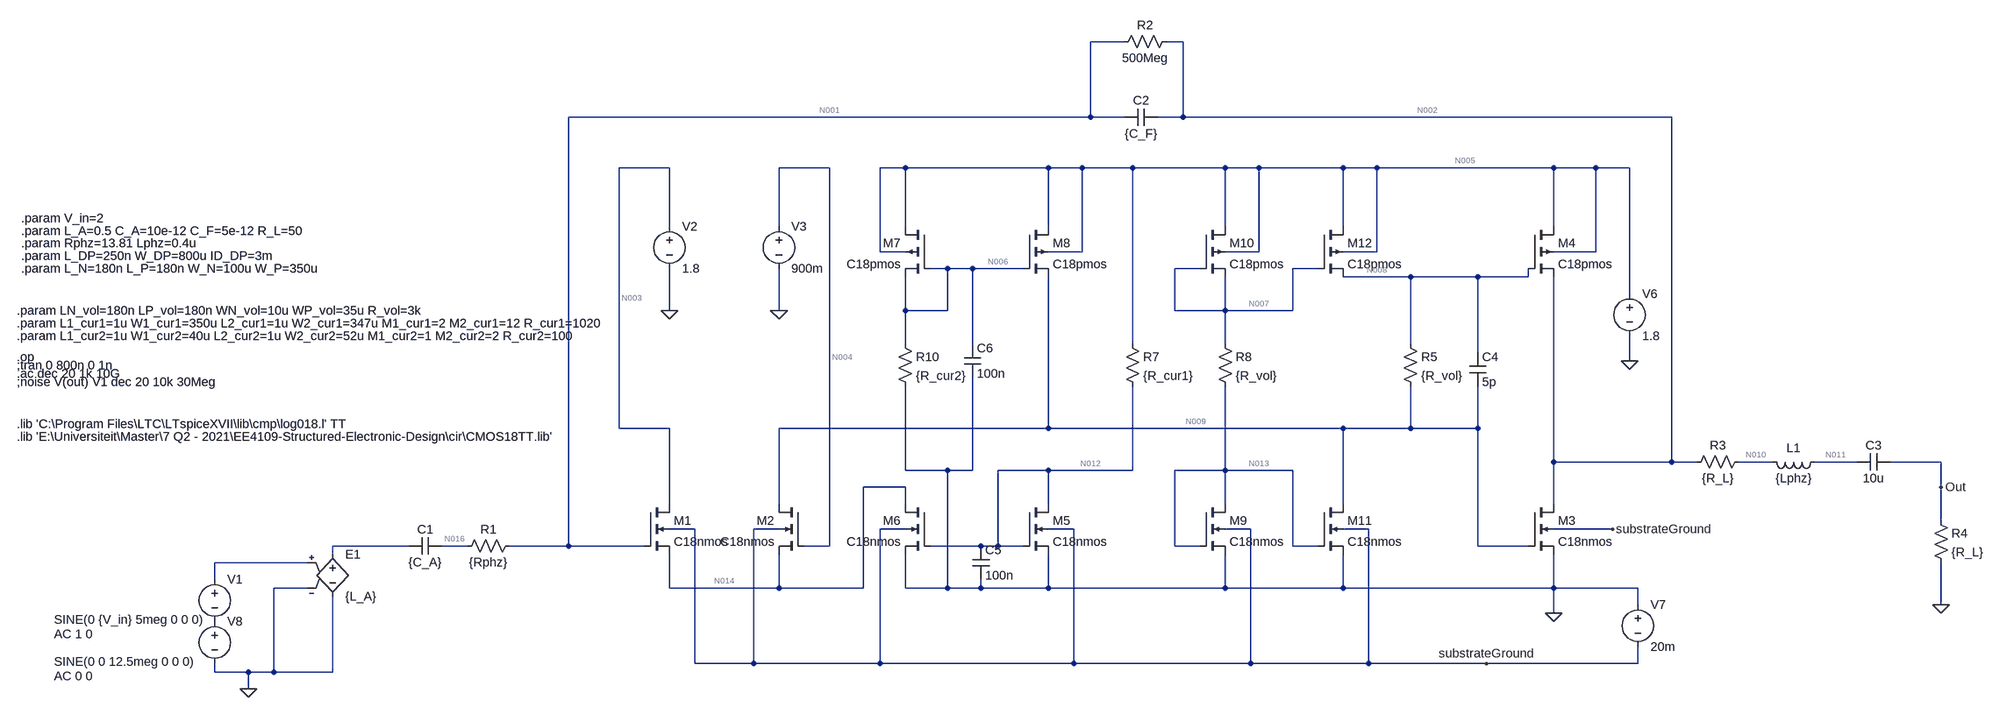
[diagram p0: schematic BiasingStep4.asc]
BiasingStep4.asc, the LTspice schematic file:
Version 4
SHEET 1 5536 1444
WIRE 2384 -768 2320 -768
WIRE 2496 -768 2464 -768
WIRE 2320 -624 2320 -768
WIRE 2320 -624 1328 -624
WIRE 2384 -624 2320 -624
WIRE 2496 -624 2496 -768
WIRE 2496 -624 2448 -624
WIRE 3424 -624 2496 -624
WIRE 1520 -528 1424 -528
WIRE 1824 -528 1728 -528
WIRE 1968 -528 1920 -528
WIRE 2240 -528 1968 -528
WIRE 2304 -528 2240 -528
WIRE 2400 -528 2304 -528
WIRE 2576 -528 2400 -528
WIRE 2640 -528 2576 -528
WIRE 2800 -528 2640 -528
WIRE 2864 -528 2800 -528
WIRE 3200 -528 2864 -528
WIRE 3280 -528 3200 -528
WIRE 3344 -528 3280 -528
WIRE 1520 -416 1520 -528
WIRE 1728 -416 1728 -528
WIRE 1968 -416 1968 -528
WIRE 2240 -416 2240 -528
WIRE 2576 -416 2576 -528
WIRE 2800 -416 2800 -528
WIRE 3200 -416 3200 -528
WIRE 1920 -368 1920 -528
WIRE 1968 -368 1920 -368
WIRE 2304 -368 2304 -528
WIRE 2304 -368 2240 -368
WIRE 2640 -368 2640 -528
WIRE 2640 -368 2576 -368
WIRE 2864 -368 2864 -528
WIRE 2864 -368 2800 -368
WIRE 3280 -368 3280 -528
WIRE 3280 -368 3200 -368
WIRE 2048 -336 2016 -336
WIRE 2096 -336 2048 -336
WIRE 2192 -336 2096 -336
WIRE 2528 -336 2480 -336
WIRE 2752 -336 2704 -336
WIRE 2928 -320 2800 -320
WIRE 3056 -320 2928 -320
WIRE 3152 -320 3152 -336
WIRE 3152 -320 3056 -320
WIRE 3344 -288 3344 -528
WIRE 1520 -256 1520 -336
WIRE 1728 -256 1728 -336
WIRE 1968 -256 1968 -320
WIRE 2048 -256 2048 -336
WIRE 2048 -256 1968 -256
WIRE 2480 -256 2480 -336
WIRE 2576 -256 2576 -320
WIRE 2576 -256 2480 -256
WIRE 2704 -256 2704 -336
WIRE 2704 -256 2576 -256
WIRE 1968 -192 1968 -256
WIRE 2096 -192 2096 -336
WIRE 2400 -192 2400 -528
WIRE 2576 -192 2576 -256
WIRE 2928 -192 2928 -320
WIRE 3056 -176 3056 -320
WIRE 3344 -160 3344 -208
WIRE 1424 -32 1424 -528
WIRE 1520 -32 1424 -32
WIRE 2240 -32 2240 -320
WIRE 2240 -32 1728 -32
WIRE 2800 -32 2240 -32
WIRE 2928 -32 2928 -112
WIRE 2928 -32 2800 -32
WIRE 3056 -32 3056 -112
WIRE 3056 -32 2928 -32
WIRE 3200 32 3200 -320
WIRE 3424 32 3424 -624
WIRE 3424 32 3200 32
WIRE 3472 32 3424 32
WIRE 3616 32 3552 32
WIRE 3776 32 3696 32
WIRE 3936 32 3840 32
WIRE 1968 48 1968 -112
WIRE 2048 48 1968 48
WIRE 2096 48 2096 -128
WIRE 2096 48 2048 48
WIRE 2240 48 2144 48
WIRE 2400 48 2400 -112
WIRE 2400 48 2240 48
WIRE 2576 48 2576 -112
WIRE 2576 48 2480 48
WIRE 2704 48 2576 48
WIRE 1968 80 1888 80
WIRE 3936 80 3936 32
WIRE 1520 112 1520 -32
WIRE 1728 112 1728 -32
WIRE 1968 112 1968 80
WIRE 2240 112 2240 48
WIRE 2576 112 2576 48
WIRE 2800 112 2800 -32
WIRE 3200 112 3200 32
WIRE 3936 144 3936 80
WIRE 1568 160 1520 160
WIRE 1728 160 1680 160
WIRE 1968 160 1920 160
WIRE 2288 160 2240 160
WIRE 2624 160 2576 160
WIRE 2848 160 2800 160
WIRE 3312 160 3200 160
WIRE 1024 192 880 192
WIRE 1136 192 1088 192
WIRE 1328 192 1328 -624
WIRE 1328 192 1216 192
WIRE 1472 192 1328 192
WIRE 1824 192 1824 -528
WIRE 1824 192 1776 192
WIRE 2112 192 2016 192
WIRE 2144 192 2144 48
WIRE 2144 192 2112 192
WIRE 2192 192 2144 192
WIRE 2480 192 2480 48
WIRE 2528 192 2480 192
WIRE 2704 192 2704 48
WIRE 2752 192 2704 192
WIRE 3056 192 3056 -32
WIRE 3152 192 3056 192
WIRE 880 208 880 192
WIRE 832 224 656 224
WIRE 656 256 656 224
WIRE 832 272 768 272
WIRE 1520 272 1520 208
WIRE 1728 272 1728 208
WIRE 1728 272 1520 272
WIRE 1888 272 1888 80
WIRE 1888 272 1728 272
WIRE 1968 272 1968 208
WIRE 2048 272 2048 48
WIRE 2048 272 1968 272
WIRE 2112 272 2112 256
WIRE 2112 272 2048 272
WIRE 2240 272 2240 208
WIRE 2240 272 2112 272
WIRE 2576 272 2576 208
WIRE 2576 272 2240 272
WIRE 2800 272 2800 208
WIRE 2800 272 2576 272
WIRE 3200 272 3200 208
WIRE 3200 272 2800 272
WIRE 3360 272 3200 272
WIRE 3360 304 3360 272
WIRE 3936 304 3936 224
WIRE 3200 320 3200 272
WIRE 1568 416 1568 160
WIRE 1680 416 1680 160
WIRE 1680 416 1568 416
WIRE 1920 416 1920 160
WIRE 1920 416 1680 416
WIRE 2288 416 2288 160
WIRE 2288 416 1920 416
WIRE 2624 416 2624 160
WIRE 2624 416 2288 416
WIRE 2848 416 2848 160
WIRE 2848 416 2624 416
WIRE 3072 416 2848 416
WIRE 3360 416 3360 384
WIRE 3360 416 3072 416
WIRE 656 432 656 416
WIRE 720 432 656 432
WIRE 768 432 768 272
WIRE 768 432 720 432
WIRE 880 432 880 288
WIRE 880 432 768 432
WIRE 720 464 720 432
FLAG 720 464 0
FLAG 3200 320 0
FLAG 3344 -160 0
FLAG 3936 304 0
FLAG 3312 160 substrateGround
FLAG 3936 80 Out
FLAG 3072 416 substrateGround
FLAG 1728 -256 0
FLAG 1520 -256 0
DATAFLAG 1408 192 ""
DATAFLAG 1728 -32 ""
DATAFLAG 3280 32 ""
DATAFLAG 3936 32 ""
DATAFLAG 1520 -64 "Id(M1)"
DATAFLAG 1520 -32 ""
DATAFLAG 1728 -64 "Id(M2)"
DATAFLAG 1808 272 ""
DATAFLAG 3200 -240 "Id(M3)"
DATAFLAG 3056 192 ""
DATAFLAG 3072 -320 ""
DATAFLAG 2400 -256 "Id(M1)"
DATAFLAG 1808 304 "Id(M6)"
DATAFLAG 1968 -240 "Id(M5)"
DATAFLAG 2240 -240 "Id(M8)"
SYMBOL voltage 656 240 R0
WINDOW 3 -305 92 Left 2
WINDOW 123 -305 120 Left 2
WINDOW 39 0 0 Left 0
SYMATTR Value SINE(0 {V_in} 5meg 0 0 0)
SYMATTR Value2 AC 1 0
SYMATTR InstName V1
SYMBOL e 880 192 R0
SYMATTR InstName E1
SYMATTR Value {L_A}
SYMBOL cap 1088 176 R90
WINDOW 0 0 32 VBottom 2
WINDOW 3 32 32 VTop 2
SYMATTR InstName C1
SYMATTR Value {C_A}
SYMBOL res 1232 176 R90
WINDOW 0 0 56 VBottom 2
WINDOW 3 32 56 VTop 2
SYMATTR InstName R1
SYMATTR Value {Rphz}
SYMBOL voltage 1520 -432 R0
WINDOW 123 0 0 Left 0
WINDOW 39 0 0 Left 0
SYMATTR InstName V2
SYMATTR Value 1.8
SYMBOL voltage 1728 -432 R0
WINDOW 123 0 0 Left 0
WINDOW 39 0 0 Left 0
SYMATTR InstName V3
SYMATTR Value 900m
SYMBOL nmos4 1472 112 R0
SYMATTR InstName M1
SYMATTR Value C18nmos
SYMATTR Value2 l={L_DP} w={W_DP}
SYMBOL nmos4 1776 112 M0
SYMATTR InstName M2
SYMATTR Value C18nmos
SYMATTR Value2 l={L_DP} w={W_DP}
SYMBOL nmos4 3152 112 R0
SYMATTR InstName M3
SYMATTR Value C18nmos
SYMATTR Value2 l={L_N} w={W_N}
SYMBOL pmos4 3152 -416 R0
SYMATTR InstName M4
SYMATTR Value C18pmos
SYMATTR Value2 l={L_P} w={W_P}
SYMBOL voltage 3344 -304 R0
WINDOW 123 0 0 Left 0
WINDOW 39 0 0 Left 0
SYMATTR InstName V6
SYMATTR Value 1.8
SYMBOL cap 2448 -640 R90
WINDOW 0 0 32 VBottom 2
WINDOW 3 32 32 VTop 2
SYMATTR InstName C2
SYMATTR Value {C_F}
SYMBOL res 2480 -784 R90
WINDOW 0 0 56 VBottom 2
WINDOW 3 32 56 VTop 2
SYMATTR InstName R2
SYMATTR Value 500Meg
SYMBOL res 3568 16 R90
WINDOW 0 0 56 VBottom 2
WINDOW 3 32 56 VTop 2
SYMATTR InstName R3
SYMATTR Value {R_L}
SYMBOL cap 3840 16 R90
WINDOW 0 0 32 VBottom 2
WINDOW 3 32 32 VTop 2
SYMATTR InstName C3
SYMATTR Value 10u
SYMBOL res 3920 128 R0
SYMATTR InstName R4
SYMATTR Value {R_L}
SYMBOL voltage 3360 288 R0
WINDOW 123 0 0 Left 0
WINDOW 39 0 0 Left 0
SYMATTR InstName V7
SYMATTR Value 20m
SYMBOL ind 3712 16 R90
WINDOW 0 5 56 VBottom 2
WINDOW 3 32 56 VTop 2
SYMATTR InstName L1
SYMATTR Value {Lphz}
SYMBOL voltage 656 320 R0
WINDOW 3 -305 92 Left 2
WINDOW 123 -305 120 Left 2
WINDOW 39 0 0 Left 0
SYMATTR Value SINE(0 0 12.5meg 0 0 0)
SYMATTR Value2 AC 0 0
SYMATTR InstName V8
SYMBOL nmos4 2528 112 R0
SYMATTR InstName M9
SYMATTR Value C18nmos
SYMATTR Value2 l={LN_vol} w={WN_vol} m=6
SYMBOL pmos4 2528 -416 R0
SYMATTR InstName M10
SYMATTR Value C18pmos
SYMATTR Value2 l={LP_vol} w={WP_vol} m=6
SYMBOL res 2560 -208 R0
SYMATTR InstName R8
SYMATTR Value {R_vol}
SYMBOL cap 3040 -176 R0
SYMATTR InstName C4
SYMATTR Value 5p
SYMBOL nmos4 2752 112 R0
SYMATTR InstName M11
SYMATTR Value C18nmos
SYMATTR Value2 l={LN_vol} w={WN_vol} m=5
SYMBOL pmos4 2752 -416 R0
SYMATTR InstName M12
SYMATTR Value C18pmos
SYMATTR Value2 l={LP_vol} w={WP_vol} m=5
SYMBOL res 2912 -208 R0
SYMATTR InstName R5
SYMATTR Value {R_vol}
SYMBOL nmos4 2192 112 R0
SYMATTR InstName M5
SYMATTR Value C18nmos
SYMATTR Value2 l={L1_cur1} w={W1_cur1} m={M1_cur1}
SYMBOL res 2384 -208 R0
SYMATTR InstName R7
SYMATTR Value {R_cur1}
SYMBOL nmos4 2016 112 M0
SYMATTR InstName M6
SYMATTR Value C18nmos
SYMATTR Value2 l={L2_cur1} w={W2_cur1} m={M2_cur1}
SYMBOL res 1952 -208 R0
SYMATTR InstName R10
SYMATTR Value {R_cur2}
SYMBOL pmos4 2016 -416 M0
SYMATTR InstName M7
SYMATTR Value C18pmos
SYMATTR Value2 l={L1_cur2} w={W1_cur2} m={M1_cur2}
SYMBOL pmos4 2192 -416 R0
SYMATTR InstName M8
SYMATTR Value C18pmos
SYMATTR Value2 l={L2_cur2} w={W2_cur2} m={M2_cur2}
SYMBOL cap 2096 192 R0
SYMATTR InstName C5
SYMATTR Value 100n
SYMBOL cap 2080 -192 R0
SYMATTR InstName C6
SYMATTR Value 100n
TEXT 288 -408 Left 2 !.param L_A=0.5 C_A=10e-12 C_F=5e-12 R_L=50
TEXT 288 -384 Left 2 !.param Rphz=13.81 Lphz=0.4u
TEXT 288 -360 Left 2 !.param L_DP=250n W_DP=800u ID_DP=3m
TEXT 288 -336 Left 2 !.param L_N=180n L_P=180n W_N=100u W_P=350u
TEXT 280 -168 Left 2 !.op
TEXT 280 -16 Left 2 !.lib 'E:\\Universiteit\\Master\\7 Q2 - 2021\\EE4109-Structured-Electronic-Design\\cir\\CMOS18TT.lib'
TEXT 280 -40 Left 2 !.lib 'C:\\Program Files\\LTC\\LTspiceXVII\\lib\\cmp\\log018.l' TT
TEXT 288 -432 Left 2 !.param V_in=2
TEXT 280 -152 Left 2 !;tran 0 800n 0 1n
TEXT 280 -136 Left 2 !.ac dec 20 1k 10G
TEXT 280 -120 Left 2 !;noise V(out) V1 dec 20 10k 30Meg
TEXT 280 -256 Left 2 !.param LN_vol=180n LP_vol=180n WN_vol=10u WP_vol=35u R_vol=3k
TEXT 280 -232 Left 2 !.param L1_cur1=1u W1_cur1=350u L2_cur1=1u W2_cur1=347u M1_cur1=2 M2_cur1=12 R_cur1=1020
TEXT 280 -208 Left 2 !.param L1_cur2=1u W1_cur2=40u L2_cur2=1u W2_cur2=52u M1_cur2=1 M2_cur2=2 R_cur2=100

The netlist it stands for:
* BiasingStep4.asc
V1 N017 P001 SINE(0 {V_in} 5meg 0 0 0) AC 1 0
E1 N015 0 N017 0 {L_A}
C1 N016 N015 {C_A}
R1 N001 N016 {Rphz}
V2 N003 0 1.8
V3 N004 0 900m
M1 N003 N001 N014 substrateGround C18nmos l={L_DP} w={W_DP}
M2 N009 N004 N014 substrateGround C18nmos l={L_DP} w={W_DP}
M3 N002 N009 0 substrateGround C18nmos l={L_N} w={W_N}
M4 N005 N008 N002 N005 C18pmos l={L_P} w={W_P}
V6 N005 0 1.8
C2 N002 N001 {C_F}
R2 N002 N001 500Meg
R3 N010 N002 {R_L}
C3 Out N011 10u
R4 Out 0 {R_L}
V7 0 substrateGround 20m
L1 N011 N010 {Lphz}
V8 P001 0 SINE(0 0 12.5meg 0 0 0) AC 0 0
M9 N013 N013 0 substrateGround C18nmos l={LN_vol} w={WN_vol} m=6
M10 N005 N007 N007 N005 C18pmos l={LP_vol} w={WP_vol} m=6
R8 N007 N013 {R_vol}
C4 N008 N009 5p
M11 N009 N013 0 substrateGround C18nmos l={LN_vol} w={WN_vol} m=5
M12 N005 N007 N008 N005 C18pmos l={LP_vol} w={WP_vol} m=5
R5 N008 N009 {R_vol}
M5 N012 N012 0 substrateGround C18nmos l={L1_cur1} w={W1_cur1} m={M1_cur1}
R7 N005 N012 {R_cur1}
M6 N014 N012 0 substrateGround C18nmos l={L2_cur1} w={W2_cur1} m={M2_cur1}
R10 N006 0 {R_cur2}
M7 N005 N006 N006 N005 C18pmos l={L1_cur2} w={W1_cur2} m={M1_cur2}
M8 N005 N006 N009 N005 C18pmos l={L2_cur2} w={W2_cur2} m={M2_cur2}
C5 N012 0 100n
C6 N006 0 100n
.model NMOS NMOS
.model PMOS PMOS
.lib standard.mos
.param L_A=0.5 C_A=10e-12 C_F=5e-12 R_L=50
.param Rphz=13.81 Lphz=0.4u
.param L_DP=250n W_DP=800u ID_DP=3m
.param L_N=180n L_P=180n W_N=100u W_P=350u
.op
.lib 'E:\Universiteit\Master\7 Q2 - 2021\EE4109-Structured-Electronic-Design\cir\CMOS18TT.lib'
.lib 'C:\Program Files\LTC\LTspiceXVII\lib\cmp\log018.l' TT
.param V_in=2
;tran 0 800n 0 1n
.ac dec 20 1k 10G
;noise V(out) V1 dec 20 10k 30Meg
.param LN_vol=180n LP_vol=180n WN_vol=10u WP_vol=35u R_vol=3k
.param L1_cur1=1u W1_cur1=350u L2_cur1=1u W2_cur1=347u M1_cur1=2 M2_cur1=12 R_cur1=1020
.param L1_cur2=1u W1_cur2=40u L2_cur2=1u W2_cur2=52u M1_cur2=1 M2_cur2=2 R_cur2=100
.backanno
.end

* Results of the author's LTspice run, read from the files saved beside the schematic
* Operating Point, zero values left out:
*   V(n016) = 889.2 mV
*   V(n001) = 889.2 mV
*   V(n003) = 1.8 V
*   V(n004) = 900 mV
*   V(n014) = 263.3 mV
*   V(substrateground) = -20 mV
*   V(n009) = 595.8 mV
*   V(n002) = 889.2 mV
*   V(n005) = 1.8 V
*   V(n008) = 1.202 V
*   V(n010) = 889.2 mV
*   V(n011) = 889.2 mV
*   V(n013) = 540.9 mV
*   V(n007) = 1.258 V
*   V(n012) = 545 mV
*   V(n006) = 140.6 mV
*   Id(M8) = 3.604 mA
*   Ib(M8) = 2.428 pA
*   Is(M8) = -3.604 mA
*   Id(M7) = 1.406 mA
*   Ib(M7) = 1.669 pA
*   Is(M7) = -1.406 mA
*   Id(M12) = 201.9 µA
*   Ib(M12) = 3.042 pA
*   Is(M12) = -201.9 µA
*   Id(M10) = 239.1 µA
*   Ib(M10) = 3.311 pA
*   Is(M10) = -239.1 µA
*   Id(M4) = 1.098 mA
*   Is(M4) = -1.098 mA
*   Id(M6) = 7.214 mA
*   Ib(M6) = -3.824 pA
*   Is(M6) = -7.214 mA
*   Id(M5) = 1.23 mA
*   Ib(M5) = -1.201 pA
*   Is(M5) = -1.23 mA
*   Id(M11) = 203 µA
*   Ib(M11) = -3.256 pA
*   Is(M11) = -203 µA
*   Id(M9) = 239.1 µA
*   Ib(M9) = -3.578 pA
*   Is(M9) = -239.1 µA
*   Id(M3) = 1.098 mA
*   Is(M3) = -1.098 mA
*   Id(M2) = 3.603 mA
*   Is(M2) = -3.603 mA
*   Id(M1) = 3.611 mA
*   Ib(M1) = -2.123 pA
*   Is(M1) = -3.611 mA
*   I(R10) = 1.406 mA
*   I(R7) = 1.23 mA
*   I(R5) = 201.9 µA
*   I(R8) = 239.1 µA
*   I(V7) = -15.85 pA
*   I(V6) = -7.779 mA
*   I(V2) = -3.611 mA
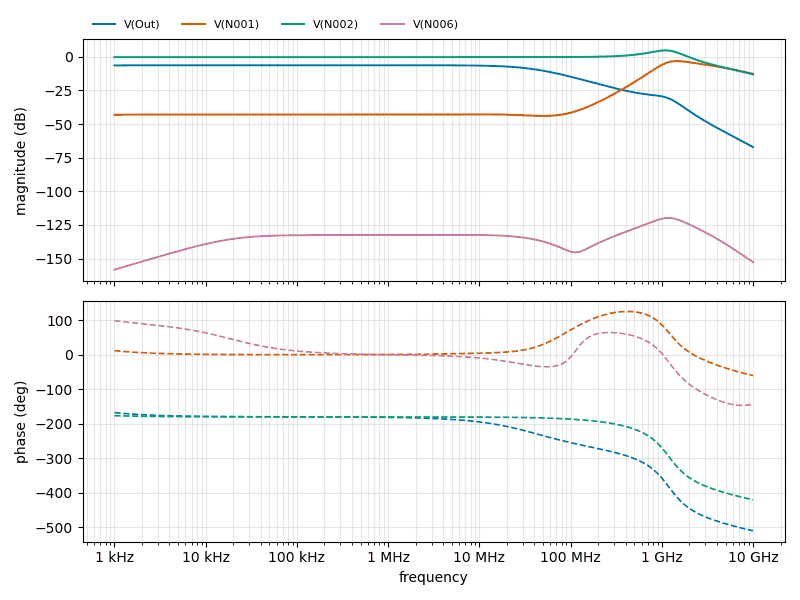
[diagram p1: AC Analysis of BiasingStep4.asc, plotted from the saved traces]
* AC Analysis, 1 run:
*   V(Out): -6.34 dB at 1 kHz, -67.07 dB at 10 GHz, peak -6.22 dB at 79.43 kHz, 3 dB below the peak at 40.02 MHz
*   V(N001): -43.04 dB at 1 kHz, -12.68 dB at 10 GHz, peak -3.13 dB at 1.413 GHz, 3 dB below the peak at 987.7 MHz and 3.244 GHz
*   V(N002): -0.22 dB at 1 kHz, -13.04 dB at 10 GHz, peak 4.81 dB at 1.122 GHz, 3 dB below the peak at 534.9 MHz and 1.674 GHz
*   V(N006): -158.25 dB at 1 kHz, -152.56 dB at 10 GHz, peak -119.80 dB at 1.122 GHz, 3 dB below the peak at 771.9 MHz and 1.747 GHz
* From the log:
*   Semiconductor Device Operating Points:
*                           --- BSIM3 MOSFETS ---
*   Name:        m8          m7          m12         m10         m4
*   Model:     c18pmos     c18pmos     c18pmos     c18pmos     c18pmos
*   Id:        3.60e-03    1.41e-03    2.02e-04    2.39e-04    1.10e-03
*   Vgs:      -4.55e-01    0.00e+00    5.65e-02    0.00e+00    3.12e-01
*   Vds:       1.20e+00    1.66e+00    5.98e-01    5.42e-01    9.11e-01
*   Vbs:       1.20e+00    1.66e+00    5.98e-01    5.42e-01    9.11e-01
*   Vth:      -4.16e-01   -4.15e-01   -4.99e-01   -4.99e-01   -4.98e-01
*   Vdsat:    -9.87e-01   -9.88e-01   -7.75e-02   -7.74e-02   -1.10e-01
*   Gm:        5.08e-03    2.00e-03    3.78e-03    4.47e-03    1.63e-02
*   Gds:       1.58e-04    3.38e-05    4.67e-05    6.00e-05    1.67e-04
*   Gmb        1.86e-03    7.28e-04    1.15e-03    1.36e-03    4.93e-03
*   Cbd:       0.00e+00    0.00e+00    0.00e+00    0.00e+00    0.00e+00
*   Cbs:       0.00e+00    0.00e+00    0.00e+00    0.00e+00    0.00e+00
*   Cgsov:     7.08e-14    2.72e-14    1.19e-13    1.43e-13    2.38e-13
*   Cgdov:     7.08e-14    2.72e-14    1.19e-13    1.43e-13    2.38e-13
*   Cgbov:     1.92e-18    9.60e-19    7.02e-19    8.42e-19    1.40e-19
*   dQgdVgb:   8.31e-13    3.19e-13    3.84e-13    4.61e-13    8.14e-13
*   dQgdVdb:  -7.08e-14   -2.67e-14   -1.19e-13   -1.43e-13   -2.38e-13
*   dQgdVsb:  -7.61e-13   -2.93e-13   -2.48e-13   -2.98e-13   -5.57e-13
*   dQddVgb:  -3.52e-13   -1.35e-13   -1.71e-13   -2.05e-13   -3.67e-13
*   dQddVdb:   7.13e-14    2.70e-14    1.19e-13    1.43e-13    2.38e-13
*   dQddVsb:   3.72e-13    1.43e-13    6.87e-14    8.23e-14    1.69e-13
*   dQbdVgb:  -1.27e-13   -4.91e-14   -4.20e-14   -5.03e-14   -8.07e-14
*   dQbdVdb:  -1.06e-15   -9.78e-18    6.31e-18    1.48e-18    3.43e-17
*   dQbdVsb:  -5.42e-14   -2.08e-14   -8.05e-15   -9.66e-15   -1.94e-14
*   Name:        m6          m5          m11         m9          m3
*   Model:     c18nmos     c18nmos     c18nmos     c18nmos     c18nmos
*   Id:        7.21e-03    1.23e-03    2.03e-04    2.39e-04    1.10e-03
*   Vgs:       5.45e-01    5.45e-01    5.41e-01    5.41e-01    5.96e-01
*   Vds:       2.63e-01    5.45e-01    5.96e-01    5.41e-01    8.89e-01
*   Vbs:      -2.00e-02   -2.00e-02   -2.00e-02   -2.00e-02   -2.00e-02
*   Vth:       4.17e-01    4.17e-01    4.86e-01    4.86e-01    4.86e-01
*   Vdsat:     1.08e-01    1.08e-01    7.20e-02    7.20e-02    1.00e-01
*   Gm:        1.07e-01    1.82e-02    3.86e-03    4.57e-03    1.60e-02
*   Gds:       6.98e-04    4.25e-05    6.96e-05    8.43e-05    2.73e-04
*   Gmb        3.00e-02    5.13e-03    8.74e-04    1.03e-03    3.56e-03
*   Cbd:       0.00e+00    0.00e+00    0.00e+00    0.00e+00    0.00e+00
*   Cbs:       0.00e+00    0.00e+00    0.00e+00    0.00e+00    0.00e+00
*   Cgsov:     2.91e-12    4.89e-13    3.49e-14    4.19e-14    6.99e-14
*   Cgdov:     2.91e-12    4.89e-13    3.49e-14    4.19e-14    6.99e-14
*   Cgbov:     1.17e-17    1.96e-18    7.88e-19    9.46e-19    1.58e-19
*   dQgdVgb:   3.39e-11    5.67e-12    1.19e-13    1.43e-13    2.50e-13
*   dQgdVdb:  -3.01e-12   -4.91e-13   -3.49e-14   -4.19e-14   -6.99e-14
*   dQgdVsb:  -2.89e-11   -4.85e-12   -7.70e-14   -9.24e-14   -1.68e-13
*   dQddVgb:  -1.41e-11   -2.36e-12   -5.30e-14   -6.36e-14   -1.12e-13
*   dQddVdb:   3.00e-12    4.91e-13    3.49e-14    4.19e-14    6.99e-14
*   dQddVsb:   1.47e-11    2.46e-12    2.27e-14    2.73e-14    5.29e-14
*   dQbdVgb:  -5.58e-12   -9.54e-13   -1.34e-14   -1.60e-14   -2.58e-14
*   dQbdVdb:  -8.82e-14   -1.38e-15   -5.35e-18   -8.71e-18   -5.79e-18
*   dQbdVsb:  -3.38e-12   -5.59e-13   -3.36e-15   -4.04e-15   -7.53e-15
*   Name:        m2          m1
*   Model:     c18nmos     c18nmos
*   Id:        3.60e-03    3.61e-03
*   Vgs:       6.37e-01    6.26e-01
*   Vds:       3.32e-01    1.54e+00
*   Vbs:      -2.83e-01   -2.83e-01
*   Vth:       5.54e-01    5.54e-01
*   Vdsat:     9.14e-02    8.55e-02
*   Gm:        6.30e-02    6.33e-02
*   Gds:       7.91e-04    9.10e-04
*   Gmb        1.40e-02    1.42e-02
*   Cbd:       0.00e+00    0.00e+00
*   Cbs:       0.00e+00    0.00e+00
*   Cgsov:     5.59e-13    5.59e-13
*   Cgdov:     5.59e-13    5.59e-13
*   Cgbov:     2.28e-19    2.28e-19
*   dQgdVgb:   2.33e-12    2.30e-12
*   dQgdVdb:  -5.60e-13   -5.59e-13
*   dQgdVsb:  -1.65e-12   -1.61e-12
*   dQddVgb:  -1.03e-12   -1.01e-12
*   dQddVdb:   5.60e-13    5.59e-13
*   dQddVsb:   5.83e-13    5.64e-13
*   dQbdVgb:  -2.71e-13   -2.76e-13
*   dQbdVdb:  -1.05e-15   -9.84e-19
*   dQbdVsb:  -7.62e-14   -7.27e-14